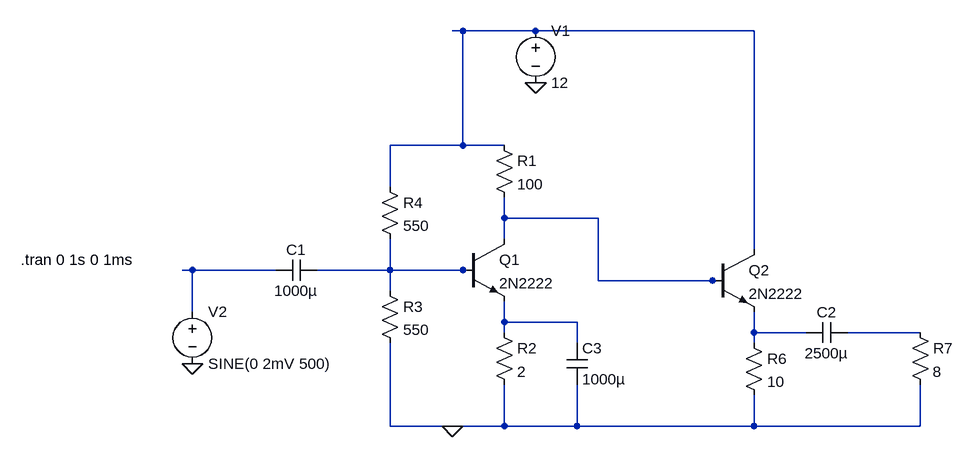
[diagram p0: schematic Common Emitter with Common Collector 2.asc]
Common Emitter with Common Collector 2.asc, the LTspice schematic file:
Version 4
SHEET 1 920 680
WIRE 160 -256 144 -256
WIRE 272 -256 160 -256
WIRE 608 -256 272 -256
WIRE 160 -80 160 -256
WIRE 160 -80 48 -80
WIRE 224 -80 160 -80
WIRE 48 -16 48 -80
WIRE 224 32 224 0
WIRE 368 32 224 32
WIRE 224 64 224 32
WIRE 608 80 608 -256
WIRE -256 112 -272 112
WIRE -128 112 -256 112
WIRE 48 112 48 64
WIRE 48 112 -64 112
WIRE 160 112 48 112
WIRE 176 112 160 112
WIRE 368 128 368 32
WIRE 544 128 368 128
WIRE 560 128 544 128
WIRE 48 144 48 112
WIRE -256 176 -256 112
WIRE 224 192 224 160
WIRE 336 192 224 192
WIRE 224 208 224 192
WIRE 608 208 608 176
WIRE 688 208 608 208
WIRE 864 208 752 208
WIRE 336 224 336 192
WIRE 608 224 608 208
WIRE 48 352 48 224
WIRE 144 352 48 352
WIRE 224 352 224 288
WIRE 224 352 144 352
WIRE 336 352 336 288
WIRE 336 352 224 352
WIRE 608 352 608 304
WIRE 608 352 336 352
WIRE 864 352 864 288
WIRE 864 352 608 352
FLAG 272 -176 0
FLAG 144 352 0
FLAG -256 256 0
SYMBOL npn 160 64 R0
SYMATTR InstName Q1
SYMATTR Value 2N2222
SYMBOL res 208 -96 R0
SYMATTR InstName R1
SYMATTR Value 100
SYMBOL voltage 272 -272 R0
WINDOW 123 0 0 Left 2
WINDOW 39 0 0 Left 2
SYMATTR InstName V1
SYMATTR Value 12
SYMBOL res 32 -32 R0
SYMATTR InstName R4
SYMATTR Value 550
SYMBOL res 32 128 R0
SYMATTR InstName R3
SYMATTR Value 550
SYMBOL res 208 192 R0
SYMATTR InstName R2
SYMATTR Value 2
SYMBOL cap 320 224 R0
SYMATTR InstName C3
SYMATTR Value 1000µ
SYMBOL cap -64 96 R90
WINDOW 0 0 32 VBottom 2
WINDOW 3 32 32 VTop 2
SYMATTR InstName C1
SYMATTR Value 1000µ
SYMBOL voltage -256 160 R0
WINDOW 123 0 0 Left 2
WINDOW 39 0 0 Left 2
SYMATTR InstName V2
SYMATTR Value SINE(0 2mV 500)
SYMBOL npn 544 80 R0
SYMATTR InstName Q2
SYMATTR Value 2N2222
SYMBOL res 592 208 R0
SYMATTR InstName R6
SYMATTR Value 10
SYMBOL res 848 192 R0
WINDOW 3 35 76 Left 2
SYMATTR Value 8
SYMATTR InstName R7
SYMBOL cap 752 192 R90
WINDOW 0 0 32 VBottom 2
WINDOW 3 32 32 VTop 2
SYMATTR InstName C2
SYMATTR Value 2500µ
TEXT -520 96 Left 2 !.tran 0 1s 0 1ms

The netlist it stands for:
* Common Emitter with Common Collector 2.asc
Q1 N002 N004 N005 0 2N2222
R1 N001 N002 100
V1 N001 0 12
R4 N001 N004 550
R3 N004 0 550
R2 N005 0 2
C3 N005 0 1000µ
C1 N004 N003 1000µ
V2 N003 0 SINE(0 2mV 500)
Q2 N001 N002 N006 0 2N2222
R6 N006 0 10
R7 N007 0 8
C2 N007 N006 2500µ
.model NPN NPN
.model PNP PNP
.lib standard.bjt
.tran 0 1s 0 1ms
.backanno
.end